# Altium schematic sheet Power.SchDoc
size A4
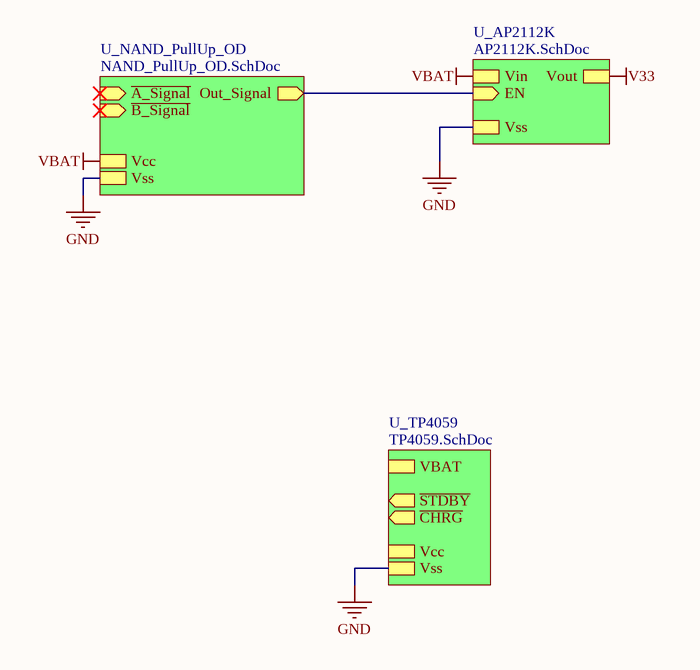
[diagram p0: Power.SchDoc]

## Sub-sheets
U_AP2112K = AP2112K.SchDoc: EN (in), Vin, Vout, Vss
U_NAND_PullUp_OD = NAND_PullUp_OD.SchDoc: ~{A_Signal} (in), Out_Signal (out), ~{B_Signal} (in), Vcc, Vss
U_TP4059 = TP4059.SchDoc: ~{CHRG} (out), ~{STDBY} (out), Vss, Vcc, VBAT

## Nets
GND: sheet U_AP2112K/Vss, sheet U_NAND_PullUp_OD/Vss, sheet U_TP4059/Vss
V33: sheet U_AP2112K/Vout
VBAT: sheet U_AP2112K/Vin, sheet U_NAND_PullUp_OD/Vcc
(unnamed): sheet U_AP2112K/EN, sheet U_NAND_PullUp_OD/Out_Signal